# EAGLE design Fly Arena Base-24 (EAGLE 5.06)
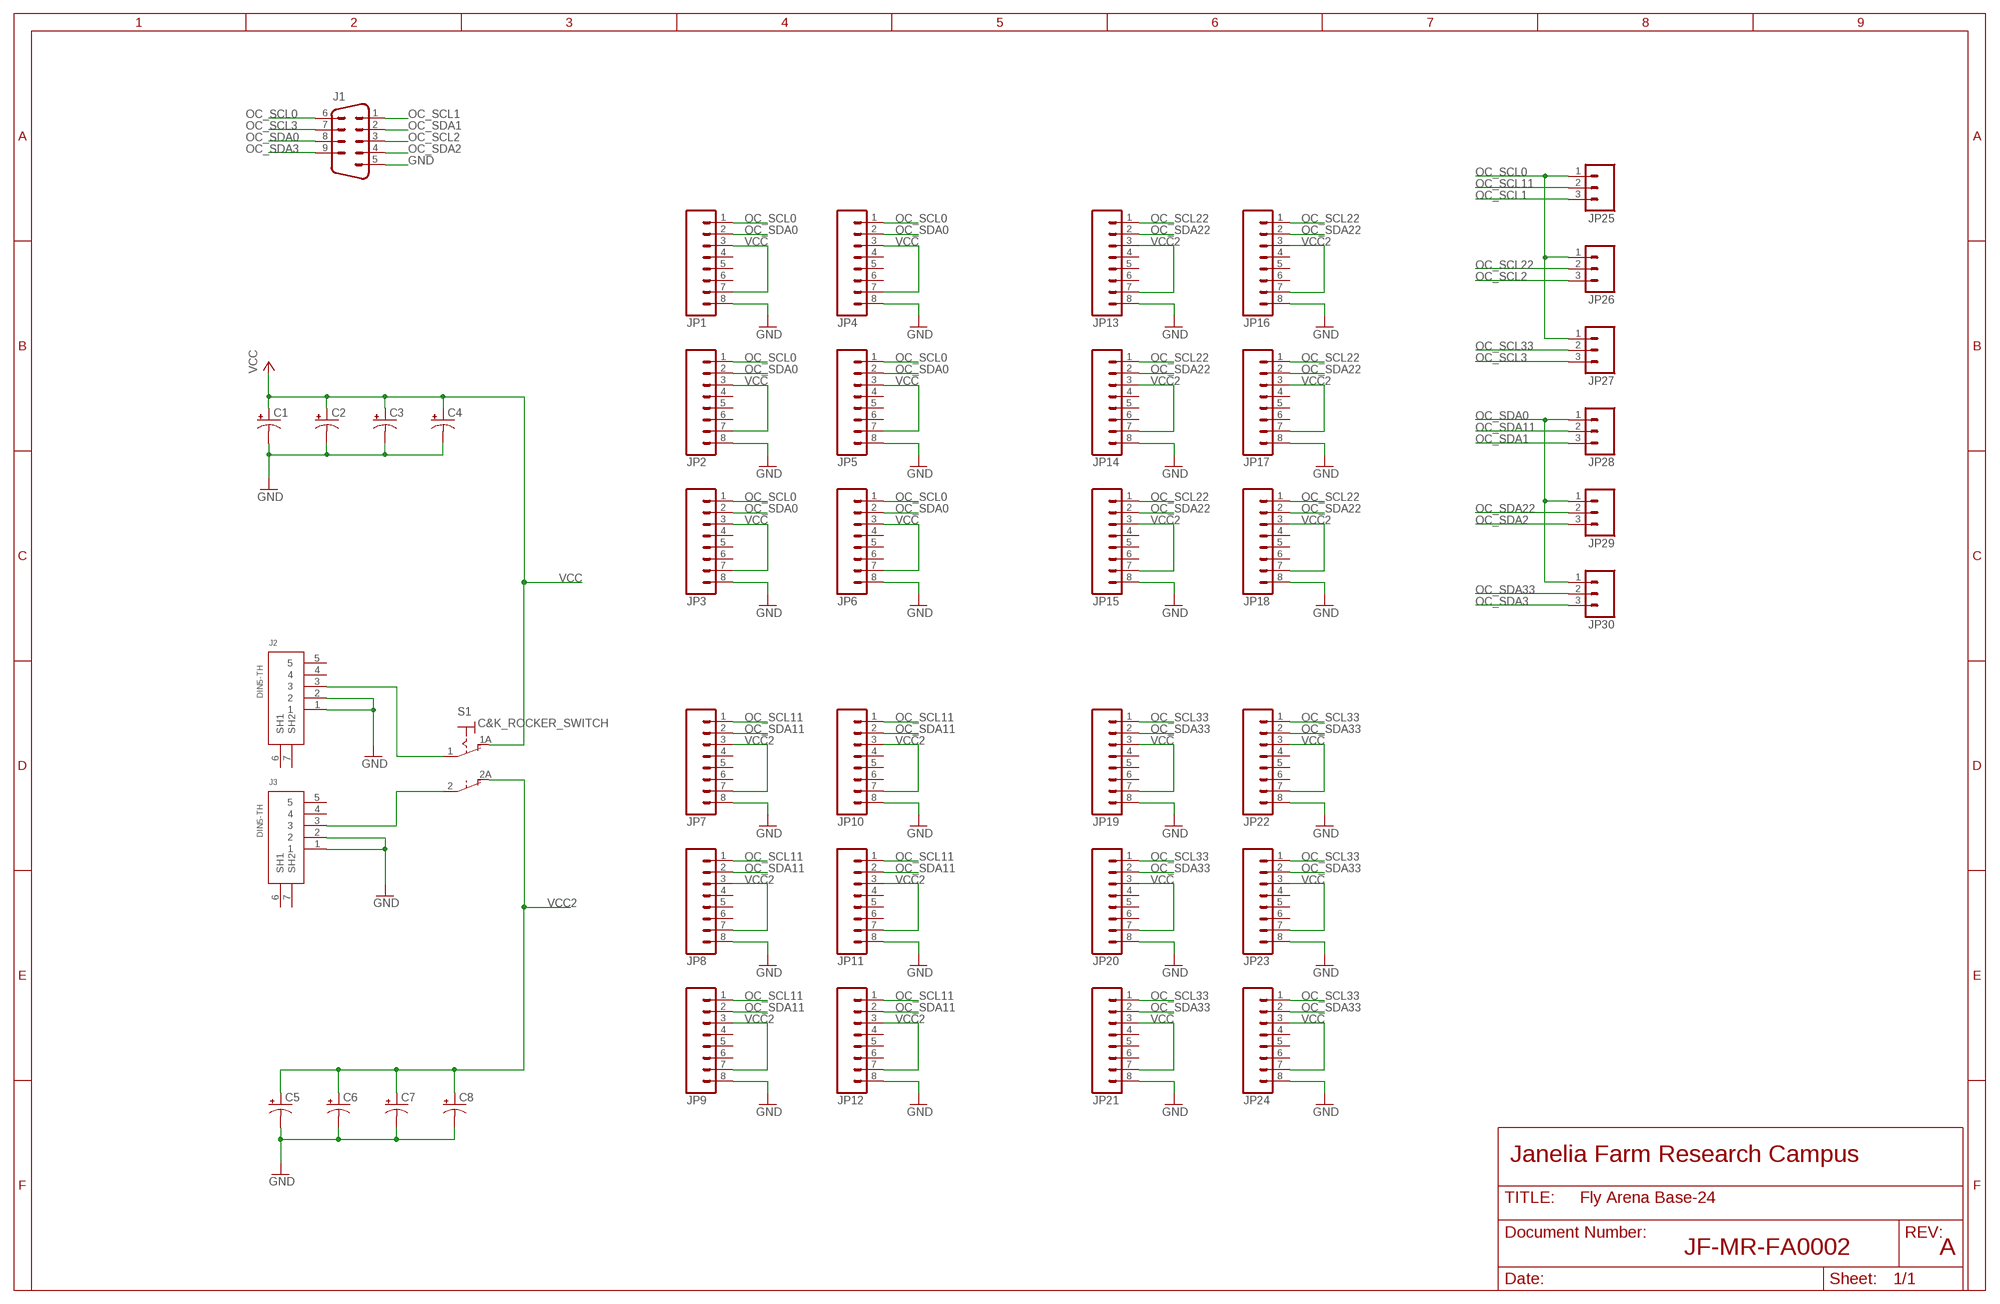
[diagram p0: schematic, sheet 1]

## Parts
C1  CPOL-USE5-10.5  [E5-10,5]
C2  CPOL-USE5-10.5  [E5-10,5]
C3  CPOL-USE5-10.5  [E5-10,5]
C4  CPOL-USE5-10.5  [E5-10,5]
C5  CPOL-USE5-10.5  [E5-10,5]
C6  CPOL-USE5-10.5  [E5-10,5]
C7  CPOL-USE5-10.5  [E5-10,5]
C8  CPOL-USE5-10.5  [E5-10,5]
J1  M09HP  [M09HP]
J2  DIN5-TH  [DIN5-TH]
J3  DIN5-TH  [DIN5-TH]
JP1  M08  [1X08]
JP2  M08  [1X08]
JP3  M08  [1X08]
JP4  M08  [1X08]
JP5  M08  [1X08]
JP6  M08  [1X08]
JP7  M08  [1X08]
JP8  M08  [1X08]
JP9  M08  [1X08]
JP10  M08  [1X08]
JP11  M08  [1X08]
JP12  M08  [1X08]
JP13  M08  [1X08]
JP14  M08  [1X08]
JP15  M08  [1X08]
JP16  M08  [1X08]
JP17  M08  [1X08]
JP18  M08  [1X08]
JP19  M08  [1X08]
JP20  M08  [1X08]
JP21  M08  [1X08]
JP22  M08  [1X08]
JP23  M08  [1X08]
JP24  M08  [1X08]
JP25  M03PTH  [1X03]
JP26  M03PTH  [1X03]
JP27  M03PTH  [1X03]
JP28  M03PTH  [1X03]
JP29  M03PTH  [1X03]
JP30  M03PTH  [1X03]
S1  C&K_ROCKER_SWITCH  [C&K_ROCKER_SWITCH]

## Nets
GND: C1.- C2.- C3.- C4.- C5.- C6.- C7.- C8.- J1.5 J2.1 J2.2 J3.1 J3.2 JP1.8 JP2.8 JP3.8 JP4.8 JP5.8 JP6.8 JP7.8 JP8.8 JP9.8 JP10.8 JP11.8 JP12.8 JP13.8 JP14.8 JP15.8 JP16.8 JP17.8 JP18.8 JP19.8 JP20.8 JP21.8 JP22.8 JP23.8 JP24.8
N$2: J3.3 S1.2
OC_SCL0: J1.6 JP1.1 JP2.1 JP3.1 JP4.1 JP5.1 JP6.1 JP25.1 JP26.1 JP27.1
OC_SCL1: J1.1 JP25.3
OC_SCL2: J1.3 JP26.3
OC_SCL3: J1.7 JP27.3
OC_SCL11: JP7.1 JP8.1 JP9.1 JP10.1 JP11.1 JP12.1 JP25.2
OC_SCL22: JP13.1 JP14.1 JP15.1 JP16.1 JP17.1 JP18.1 JP26.2
OC_SCL33: JP19.1 JP20.1 JP21.1 JP22.1 JP23.1 JP24.1 JP27.2
OC_SDA0: J1.8 JP1.2 JP2.2 JP3.2 JP4.2 JP5.2 JP6.2 JP28.1 JP29.1 JP30.1
OC_SDA1: J1.2 JP28.3
OC_SDA2: J1.4 JP29.3
OC_SDA3: J1.9 JP30.3
OC_SDA11: JP7.2 JP8.2 JP9.2 JP10.2 JP11.2 JP12.2 JP28.2
OC_SDA22: JP13.2 JP14.2 JP15.2 JP16.2 JP17.2 JP18.2 JP29.2
OC_SDA33: JP19.2 JP20.2 JP21.2 JP22.2 JP23.2 JP24.2 JP30.2
S1: J2.3 S1.1
VCC: C1.+ C2.+ C3.+ C4.+ JP1.3 JP1.7 JP2.3 JP2.7 JP3.3 JP3.7 JP4.3 JP4.7 JP5.3 JP5.7 JP6.3 JP6.7 JP19.3 JP19.7 JP20.3 JP20.7 JP21.3 JP21.7 JP22.3 JP22.7 JP23.3 JP23.7 JP24.3 JP24.7 S1.1A(O1)
VCC2: C5.+ C6.+ C7.+ C8.+ JP7.3 JP7.7 JP8.3 JP8.7 JP9.3 JP9.7 JP10.3 JP10.7 JP11.3 JP11.7 JP12.3 JP12.7 JP13.3 JP13.7 JP14.3 JP14.7 JP15.3 JP15.7 JP16.3 JP16.7 JP17.3 JP17.7 JP18.3 JP18.7 S1.2A(O2)
Unconnected: J2.4 J2.5 J2.6(SH1) J2.7(SH2) J3.4 J3.5 J3.6(SH1) J3.7(SH2) JP1.4 JP1.5 JP1.6 JP2.4 JP2.5 JP2.6 JP3.4 JP3.5 JP3.6 JP4.4 JP4.5 JP4.6 JP5.4 JP5.5 JP5.6 JP6.4 JP6.5 JP6.6 JP7.4 JP7.5 JP7.6 JP8.4 JP8.5 JP8.6 JP9.4 JP9.5 JP9.6 JP10.4 JP10.5 JP10.6 JP11.4 JP11.5 JP11.6 JP12.4 JP12.5 JP12.6 JP13.4 JP13.5 JP13.6 JP14.4 JP14.5 JP14.6 JP15.4 JP15.5 JP15.6 JP16.4 JP16.5 JP16.6 JP17.4 JP17.5 JP17.6 JP18.4 JP18.5 JP18.6 JP19.4 JP19.5 JP19.6 JP20.4 JP20.5 JP20.6 JP21.4 JP21.5 JP21.6 JP22.4 JP22.5 JP22.6 JP23.4 JP23.5 JP23.6 JP24.4 JP24.5 JP24.6

## Notes on the sheet
- Janelia Farm Research Campus
- JF-MR-FA0002 | A

## Library data of the parts
C1-C8 = resistor:CPOL-US: POLARIZED CAPACITOR, American symbol
J1 = con-subd:M09: SUB-D
J2 J3 = jfrc:DIN5-TH
JP1-JP24 = jfrc:M08: Header 8 Standard 8-pin 0.1" header. Use with straight break away headers (SKU : PRT-00116), right angle break away headers (PRT-00553), swiss pins (PRT-00743), machine pins (PRT-00117), and female headers (PRT-00115).
JP25-JP30 = SparkFun:M03: Header 3 Standard 3-pin 0.1" header. Use with straight break away headers (SKU : PRT-00116), right angle break away headers (PRT-00553), swiss pins (PRT-00743), machine pins (PRT-00117), and female headers (PRT-00115). Molex polarized connector foot print use with SKU : PRT-08232 with associated crimp pins and housings.
S1 = jfrc:C&K_ROCKER_SWITCH

## Board
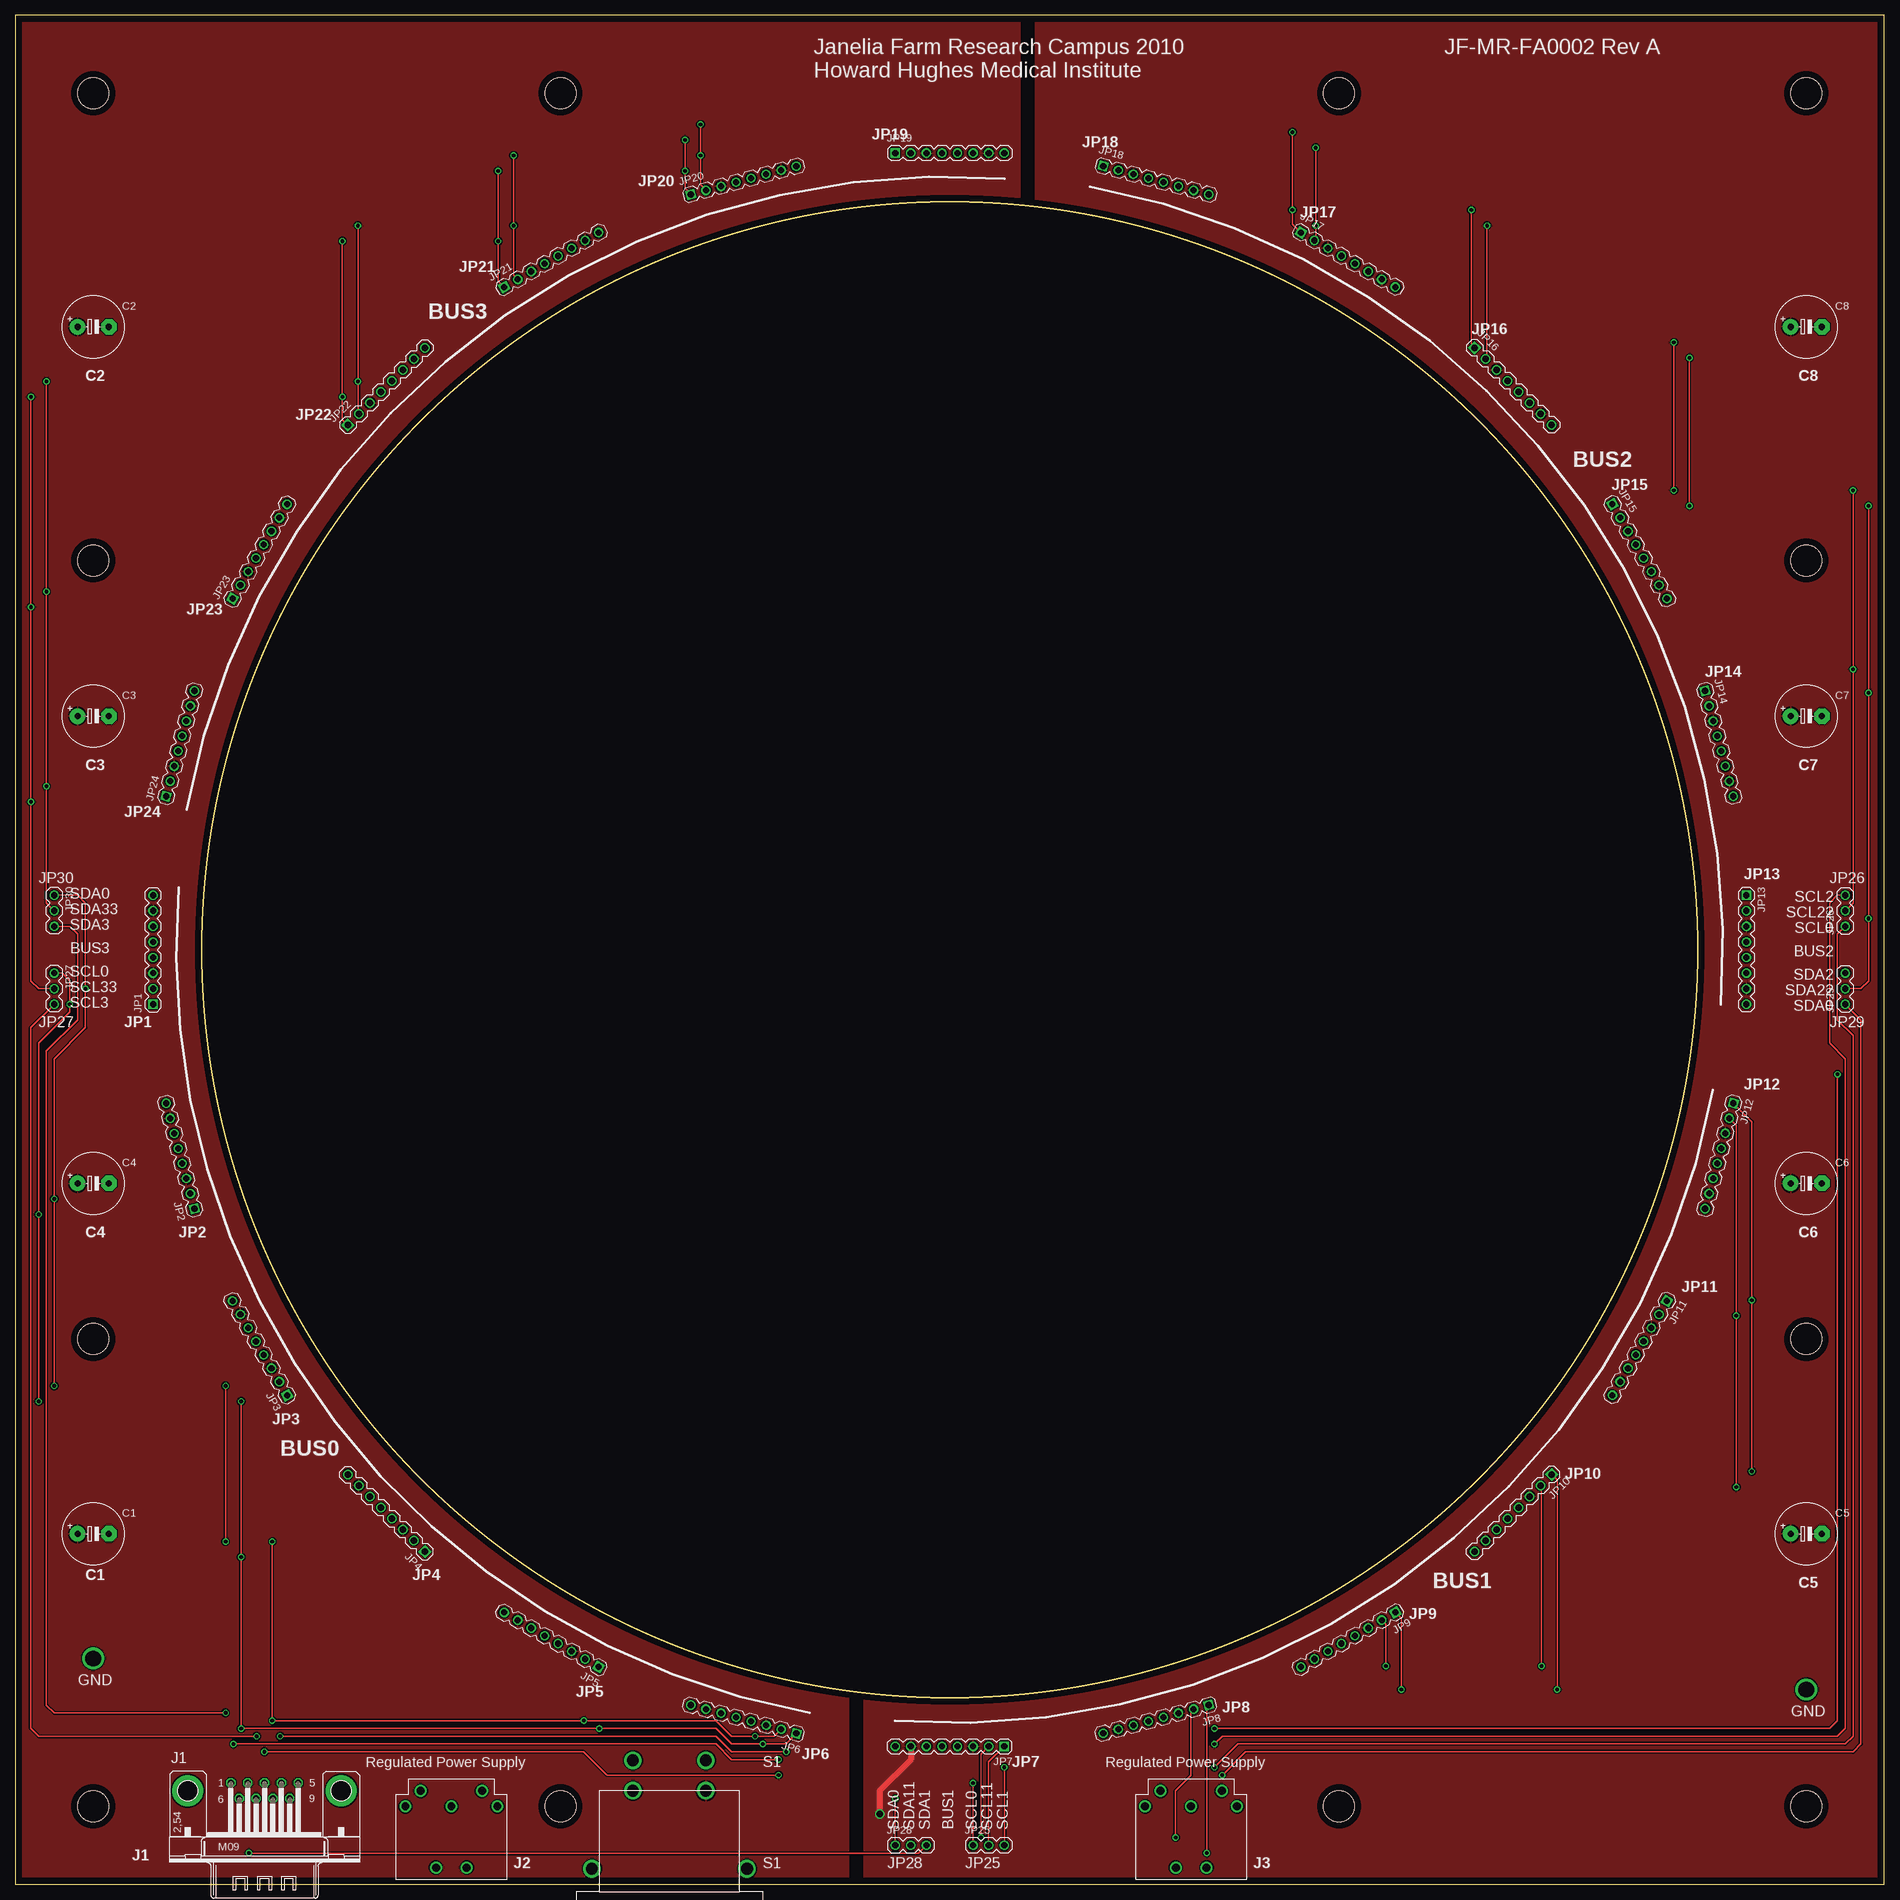
[diagram p1: board, top side]
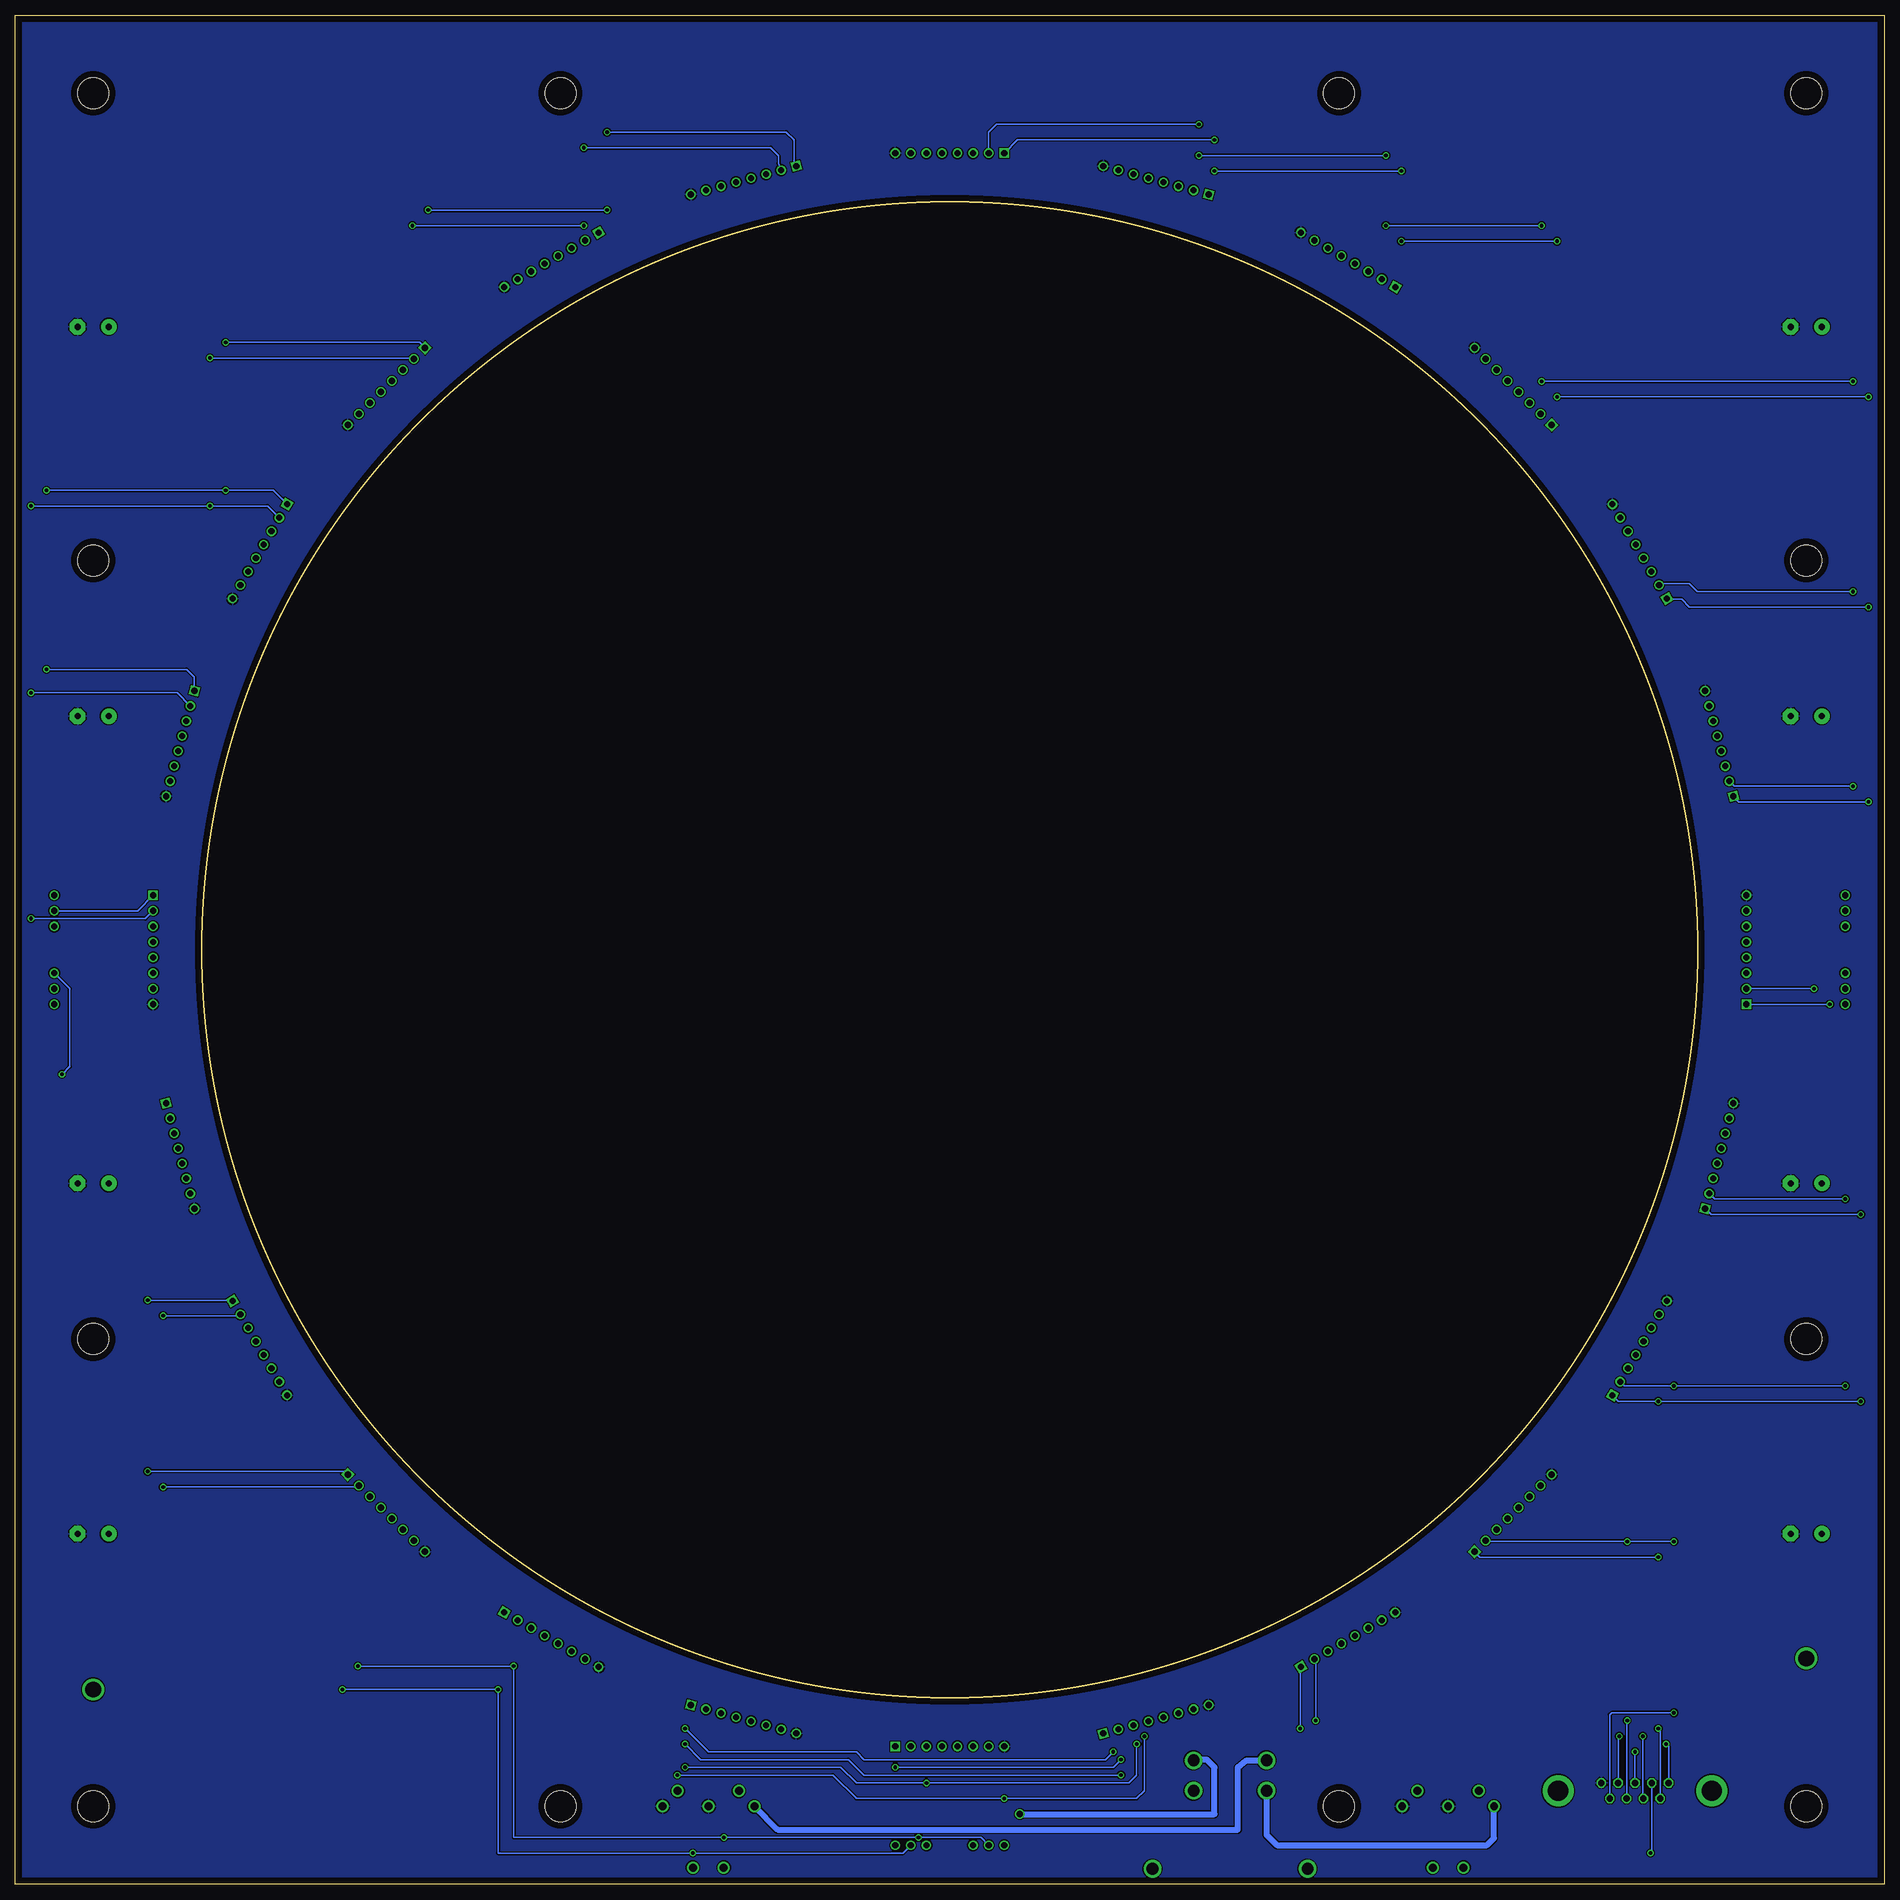
[diagram p2: board, bottom side, seen from below]

Size 304.8 x 304.8 mm. Coordinates in mm from the lower left corner, seen from the top.
Outline: 0,0 304.8,0 304.8,304.8 0,304.8 0,0
Outline: circle at 152.4,152.4 radius 121.92
Copper layers (1*16): Top 0.035mm / dielectric 1.5mm / Bottom 0.035mm
Design rules "default": minimum track width 10mil, minimum drill 24mil, track to track 8mil, track to pad 8mil, pad to pad 8mil, via to via 8mil, smd to smd 8mil, copper to edge 40mil, drill to drill 8mil, minimum pad ring 10mil, minimum via ring 8mil, stop-mask expansion 4mil, vias tented up to drill 0mil, thermal gap 10mil
Holes 5.08 mm at 292.1,12.7 292.1,292.1 12.7,292.1 12.7,12.7 88.9,292.1 215.9,292.1 12.7,215.9 12.7,88.9 292.1,88.9 292.1,215.9 215.9,12.7 88.9,12.7
Milling: area 30.5,30.5 to 274.3,274.3

### Footprints (pad centres in the part's own frame; a part is rotated, then mirrored left to right if it is on the bottom)
E5-10,5 = drill 1.016 pad 2.54 round: + -2.54,0 | drill 1.016 pad 2.54 octagon: - 2.54,0
M09HP = drill 1.016 octagon: 1 -5.486,1.27; 2 -2.743,1.27; 3 0,1.27; 4 2.743,1.27; 5 5.486,1.27; 6 -4.115,-1.27; 7 -1.372,-1.27; 8 1.372,-1.27; 9 4.115,-1.27 | drill 3.302 pad 5.08 round: G1 -12.522,0; G2 12.522,0
DIN5-TH = drill 1.3 round: 1 7.5,0; 2 0,0; 3 -7.5,0; 4 5,2.5; 5 -5,2.5; 6 2.5,-10; 7 -2.5,-10
1X08 = drill 1.016 square: 1 -17.78,0 | drill 1.016 round: 2 -15.24,0; 3 -12.7,0; 4 -10.16,0; 5 -7.62,0; 6 -5.08,0; 7 -2.54,0; 8 0,0
1X03 = drill 1.016 round: 1 0,0; 2 2.54,0; 3 5.08,0
C&K_ROCKER_SWITCH = drill 1.905 round: 1 -5.944,0; 1A 5.944,0; 2 -5.944,4.953; 2A 5.944,4.953; P$1 -12.649,-12.725; P$2 12.649,-12.725

### Placement (x,y rotation side)
C1  12.7,57.15 0 top
C2  12.7,254 0 top
C3  12.7,190.5 0 top
C4  12.7,114.3 0 top
C5  292.1,57.15 0 top
C6  292.1,114.3 0 top
C7  292.1,190.5 0 top
C8  292.1,254 0 top
J1  40.64,15.24 0 top
J2  71.12,12.7 0 top
J3  191.77,12.7 0 top
JP1  22.47,161.29 90 top
JP2  24.6,127.36 105 top
JP3  35.43,95.13 120 top
JP4  54.24,66.81 135 top
JP5  79.74,44.32 150 top
JP6  110.19,29.2 165 top
JP7  143.51,22.47 180 top
JP8  177.44,24.6 195 top
JP9  209.67,35.43 210 top
JP10  237.99,54.24 225 top
JP11  260.48,79.74 240 top
JP12  275.6,110.19 255 top
JP13  282.33,143.51 270 top
JP14  280.2,177.44 285 top
JP15  269.37,209.67 300 top
JP16  250.56,237.99 315 top
JP17  225.06,260.48 330 top
JP18  194.61,275.6 345 top
JP19  161.29,282.33 0 top
JP20  127.36,280.2 15 top
JP21  95.13,269.37 30 top
JP22  66.81,250.56 45 top
JP23  44.32,225.06 60 top
JP24  29.2,194.61 75 top
JP25  156.21,6.35 0 top
JP26  298.45,156.21 90 top
JP27  6.35,148.59 270 top
JP28  143.51,6.35 0 top
JP29  298.45,143.51 90 top
JP30  6.35,161.29 270 top
S1  106.68,15.24 0 top

### Tracks (layer width: path | path; a pad name or v marks a point on that pad's centre or on a via)
GND
  pour Bottom: 0,0 0,304.8 304.8,304.8 304.8,0
GND1  (via drill 2.54)
  other vias: 12.7,36.83
GND2  (via drill 2.54)
  other vias: 292.1,31.75
N$2
  Bottom 1.016: J3.3 180.46,8.89 105.41,8.89 105.41,19.05 104.01,20.19 S1.2
OC_SCL0  (via drill 0.61)
  Top 0.254: v36.83,78.74 v36.83,53.34 v36.83,25.4 v95.25,25.4 114.3,25.4 116.84,22.86 v121.92,22.86 125.73,22.86 127.36,24.49 JP6.1 | v3.81,78.74 v3.81,109.22 3.81,137.16 8.89,142.24 v8.89,143.51 8.89,147.32 7.62,148.59 JP27.1 | JP26.1 297.18,154.94 297.18,140.97 299.72,138.43 299.72,24.13 298.45,22.86 199.39,22.86 v195.58,19.05 | v156.21,16.51 JP25.1
  Bottom 0.254: v3.81,78.74 v36.83,78.74 43.33,78.74 JP3.1 | JP2.1 28.23,109.22 v3.81,109.22 | JP4.1 65.91,53.34 v36.83,53.34 | JP5.1 95.25,35.32 v95.25,25.4 | J1.6 36.53,25.09 v36.83,25.4 | v195.58,19.05 170.18,19.05 167.64,16.51 v156.21,16.51 123.19,16.51 121.92,17.78 v121.92,22.86 | v8.89,143.51 JP1.1
OC_SCL1  (via drill 0.61)
  Top 0.254: v161.29,19.05 JP25.3 | v124.46,20.32 116.84,20.32 114.3,22.86 v35.56,22.86
  Bottom 0.254: v161.29,19.05 125.73,19.05 v124.46,20.32 | v35.56,22.86 35.15,22.45 J1.1
OC_SCL2  (via drill 0.61)
  Top 0.254: v124.46,17.78 96.52,17.78 92.71,21.59 v40.64,21.59 | v195.58,22.86 196.85,24.13 297.18,24.13 298.45,25.4 298.45,134.62 295.91,137.16 295.91,160.02 297.18,161.29 JP26.3
  Bottom 0.254: v40.64,21.59 J1.3 | v124.46,17.78 166.37,17.78 168.91,20.32 193.04,20.32 v195.58,22.86
OC_SCL3  (via drill 0.61)
  Top 0.254: JP27.3 2.54,139.7 2.54,25.4 3.81,24.13 v39.37,24.13
  Bottom 0.254: v39.37,24.13 39.37,13.97 J1.7
OC_SCL11  (via drill 0.61)
  Top 0.254: v283.21,67.31 v283.21,95.25 283.21,124.35 JP12.1 | JP9.1 226.06,43.33 v226.06,31.75 | JP8.1 194.31,28.89 v194.31,5.08 | JP7.1 158.75,19.93 JP25.2 | v251.46,31.75 251.46,65.91 JP10.1
  Bottom 0.254: JP25.2 160.02,5.08 v194.31,5.08 226.06,5.08 v226.06,31.75 v251.46,31.75 | JP11.1 269.48,95.25 v283.21,95.25 | JP10.1 251.06,67.31 v283.21,67.31
OC_SCL22  (via drill 0.61)
  Top 0.254: v208.28,285.75 v208.28,273.05 208.28,270.75 JP17.1 | v270.51,227.33 v270.51,251.46 | v299.72,227.33 v299.72,198.12 299.72,160.02 JP26.2 | JP16.1 237.49,251.06 v237.49,273.05
  Bottom 0.254: JP18.1 177.8,280.56 177.8,284.48 179.07,285.75 v208.28,285.75 | v237.49,273.05 v208.28,273.05 | v299.72,227.33 v270.51,227.33 262.74,227.33 JP15.1 | JP14.1 275.59,196.85 276.86,198.12 v299.72,198.12 | JP13.1 284.87,158.75 JP26.2 | JP16.1 238.89,251.46 v270.51,251.46
OC_SCL33  (via drill 0.61)
  Top 0.254: v78.74,279.4 v78.74,267.97 78.74,261.47 JP21.1 | v109.22,284.48 v109.22,279.4 109.22,276.56 JP20.1 | v2.54,242.57 v2.54,208.28 v2.54,176.53 2.54,147.32 3.81,146.05 JP27.2 | JP22.1 53.34,238.89 v53.34,242.57 v53.34,267.97
  Bottom 0.254: JP19.1 141.36,284.48 v109.22,284.48 | v53.34,267.97 v78.74,267.97 | v78.74,279.4 v109.22,279.4 | JP24.1 23.69,176.53 v2.54,176.53 | v53.34,242.57 v2.54,242.57 | v2.54,208.28 31.75,208.28 33.02,209.55 35.32,209.55 JP23.1
OC_SDA0  (via drill 0.61)
  Top 0.254: v41.91,55.88 v41.91,26.67 v92.71,26.67 114.3,26.67 116.84,24.13 v120.65,24.13 123.78,24.13 JP6.2 | v34.29,55.88 v34.29,81.28 | v6.35,81.28 v6.35,111.76 6.35,134.62 11.43,139.7 v11.43,146.05 11.43,160.02 10.16,161.29 JP30.1 | JP29.1 300.99,140.97 300.99,22.86 299.72,21.59 200.66,21.59 v196.85,17.78 | v143.51,13.97 JP28.1
  Bottom 0.254: v34.29,55.88 v41.91,55.88 64.86,55.88 JP4.2 | v6.35,81.28 v34.29,81.28 42.4,81.28 JP3.2 | v11.43,146.05 JP1.2 | JP2.2 27.66,111.76 v6.35,111.76 | JP5.2 92.71,36.48 v92.71,26.67 | v196.85,17.78 171.45,17.78 167.64,13.97 v143.51,13.97 121.92,13.97 120.65,15.24 v120.65,24.13 | v41.91,26.67 42.01,26.57 J1.8
OC_SDA1  (via drill 0.61)
  Top 0.254: JP28.3 147.32,5.08 v38.1,5.08
  Bottom 0.254: J1.2 37.9,5.28 v38.1,5.08
OC_SDA2  (via drill 0.61)
  Top 0.254: v125.73,21.59 116.84,21.59 114.3,24.13 v43.18,24.13 | v195.58,25.4 295.91,25.4 297.18,26.67 v297.18,132.08
  Bottom 0.254: v125.73,21.59 127,20.32 166.37,20.32 167.64,21.59 191.77,21.59 v195.58,25.4 | v297.18,132.08 295.91,133.35 295.91,146.05 JP29.3 | v43.18,24.13 43.38,23.93 J1.4
OC_SDA3  (via drill 0.61)
  Top 0.254: JP30.3 8.89,156.21 10.16,154.94 10.16,140.97 5.08,135.89 5.08,29.21 6.35,27.94 v34.29,27.94
  Bottom 0.254: v34.29,27.94 44.45,27.94 44.76,27.64 J1.9
OC_SDA11  (via drill 0.61)
  Top 0.254: v280.67,64.77 v280.67,92.71 280.67,123.78 JP12.2 | JP9.2 223.52,42.4 v223.52,35.56 | JP8.2 191.77,28.15 191.77,17.78 189.23,15.24 v189.23,7.62 | JP7.2 157.48,21.2 v157.48,7.62 | v248.92,35.56 248.92,64.86 JP10.2
  Bottom 0.254: JP28.2 147.32,7.62 v157.48,7.62 v189.23,7.62 223.52,7.62 v223.52,35.56 v248.92,35.56 | 249.01,64.77 v280.67,64.77 | JP11.2 268.32,92.71 v280.67,92.71 | JP10.2 249.01,64.77 | 249.01,64.77 248.92,64.77
OC_SDA22  (via drill 0.61)
  Top 0.254: v212.09,283.21 v212.09,270.51 212.09,268.32 JP17.2 | v273.05,224.79 v273.05,248.92 | v302.26,224.79 v302.26,194.31 v302.26,157.48 302.26,147.32 300.99,146.05 JP29.2 | JP16.2 240.03,249.01 v240.03,270.51
  Bottom 0.254: JP18.2 180.34,280.67 180.34,281.94 181.61,283.21 v212.09,283.21 | v240.03,270.51 v212.09,270.51 | v302.26,224.79 v273.05,224.79 263.67,224.79 JP15.2 | JP14.2 278.4,194.31 v302.26,194.31 | JP13.2 283.6,157.48 v302.26,157.48 | JP16.2 239.94,248.92 v273.05,248.92
OC_SDA33  (via drill 0.61)
  Top 0.254: JP30.2 5.08,160.02 v5.08,179.07 v5.08,210.82 v5.08,245.11 | v55.88,270.51 v55.88,245.11 55.88,239.94 JP22.2 | v81.28,281.94 v81.28,270.51 81.28,262.4 JP21.2 | v111.76,287.02 v111.76,281.94 111.76,277.14 JP20.2
  Bottom 0.254: v55.88,245.11 v5.08,245.11 | v55.88,270.51 v81.28,270.51 | v81.28,281.94 v111.76,281.94 | v111.76,287.02 144.78,287.02 146.05,285.75 JP19.2 | JP24.2 24.43,179.07 v5.08,179.07 | v5.08,210.82 30.48,210.82 31.75,212.09 36.48,212.09 JP23.2
S1
  Bottom 1.016: J2.3 63.62,7.5 64.77,6.35 99.06,6.35 100.74,8.03 S1.1
VCC
  pour Top: 0,0 0,304.8 163.83,304.8 163.83,153.67 135.89,153.67 135.89,0
VCC2  (via drill 1.02)
  Top 1.016: v140.97,11.43 140.97,15.24 146.05,20.32 JP7.7
  Bottom 1.016: S1.2A 112.5,20.32 110.49,20.32 109.22,19.05 109.22,11.43 v140.97,11.43
  pour Top: 304.8,0 138.43,0 138.43,151.13 166.37,151.13 166.37,304.8 304.8,304.8

### Text on the board
tPlace: Janelia Farm Research Campus 2010 | JF-MR-FA0002 Rev A | Howard Hughes Medical Institute | JP19 | JP18 | JP20 | JP17 | JP21 | BUS3 | JP16 | C2 | C8 | JP22 | BUS2 | JP15 | JP23 | JP14 | C3 | C7 | JP24 | JP30 | JP13 | JP26 | SCL2 | SDA0 | SCL22 | SDA33 | SCL0 | SDA3 | BUS2 | BUS3 | SDA2 | SCL0 | SDA22 | SCL33 | SDA0 | SCL3 | JP27 | JP1 | JP29 | JP12 | C4 | JP2 | C6 | JP11 | JP3 | BUS0 | JP10 | C1 | JP4 | BUS1 | C5 | JP9 | GND | JP5 | JP8 | GND | JP6 | Regulated Power Supply | JP7 | Regulated Power Supply | SDA0 | SDA11 | SDA1 | BUS1 | SCL0 | SCL11 | SCL1 | J1 | J2 | S1 | JP28 | JP25 | J3